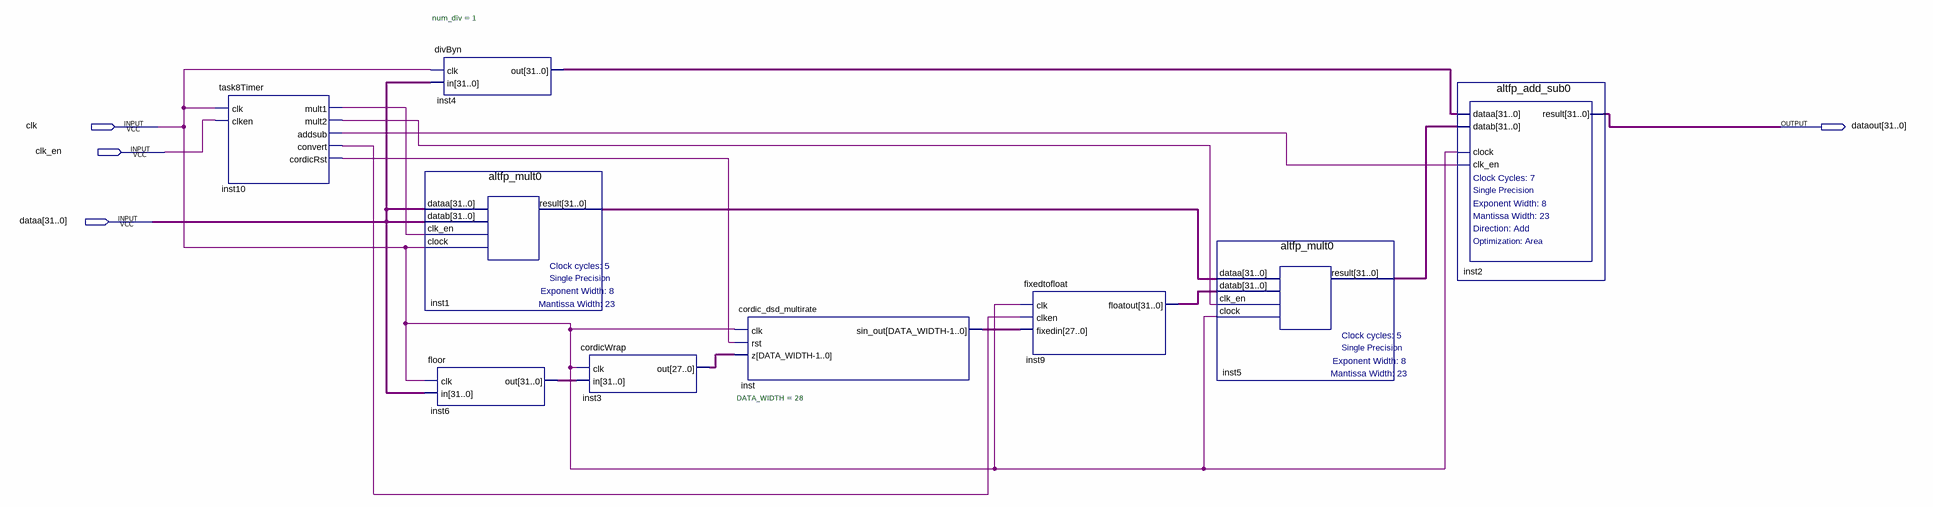
[diagram p0: schematic sheet]
// Quartus schematic task8.bdf as structural Verilog: 9 symbols, 4 pins
module task8 (
  input  clk,
  input  clk_en,
  input  [31:0] dataa,
  output [31:0] dataout
);

  wire inst10_addsub, inst10_convert, inst10_cordicrst, inst10_mult1, inst10_mult2;
  wire [27:0] inst3_out, inst_sin_out;
  wire [31:0] inst1_result, inst4_out, inst5_result, inst6_out, inst9_floatout;

  task8Timer inst10 (
    .clk(clk), .clken(clk_en), .mult1(inst10_mult1), .mult2(inst10_mult2), .addsub(inst10_addsub),
    .convert(inst10_convert), .cordicRst(inst10_cordicrst));
  divByn #(.num_div(1)) inst4 (.clk(clk), .in(dataa), .out(inst4_out));
  altfp_mult0 inst1 (.dataa(dataa), .datab(dataa), .clk_en(inst10_mult1), .clock(clk), .result(inst1_result));
  floor inst6 (.clk(clk), .in(dataa), .out(inst6_out));
  cordicWrap inst3 (.clk(clk), .in(inst6_out), .out(inst3_out));
  cordic_dsd_multirate #(.DATA_WIDTH(28)) inst (
    .clk(clk), .rst(inst10_cordicrst), .z(inst3_out), .sin_out(inst_sin_out));
  fixedtofloat inst9 (.clk(clk), .clken(inst10_convert), .fixedin(inst_sin_out), .floatout(inst9_floatout));
  altfp_mult0 inst5 (
    .dataa(inst1_result), .datab(inst9_floatout), .clk_en(inst10_mult2), .clock(clk), .result(inst5_result));
  altfp_add_sub0 inst2 (.dataa(inst4_out), .datab(inst5_result), .clock(clk), .clk_en(inst10_addsub), .result(dataout));
endmodule
